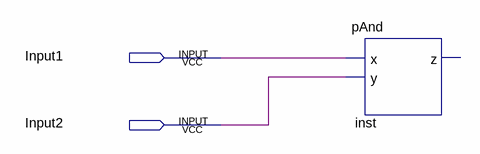
[diagram p0: schematic sheet]
// Quartus schematic block_pAnd.bdf as structural Verilog: 1 symbols, 2 pins
module block_pAnd (
  input  Input1,
  input  Input2
);

  pAnd inst (.x(Input1), .y(Input2));  // open: z
endmodule
